# EasyEDA schematic SCH_IMU_Tester_2024-10-07.json

## Sheets
1 Sheet_1: TITLE: Tester PC; REV: 1.0; Date: 2024-10-07; Sheet: 1/2; Drawn By: BillyF; Company: Figure
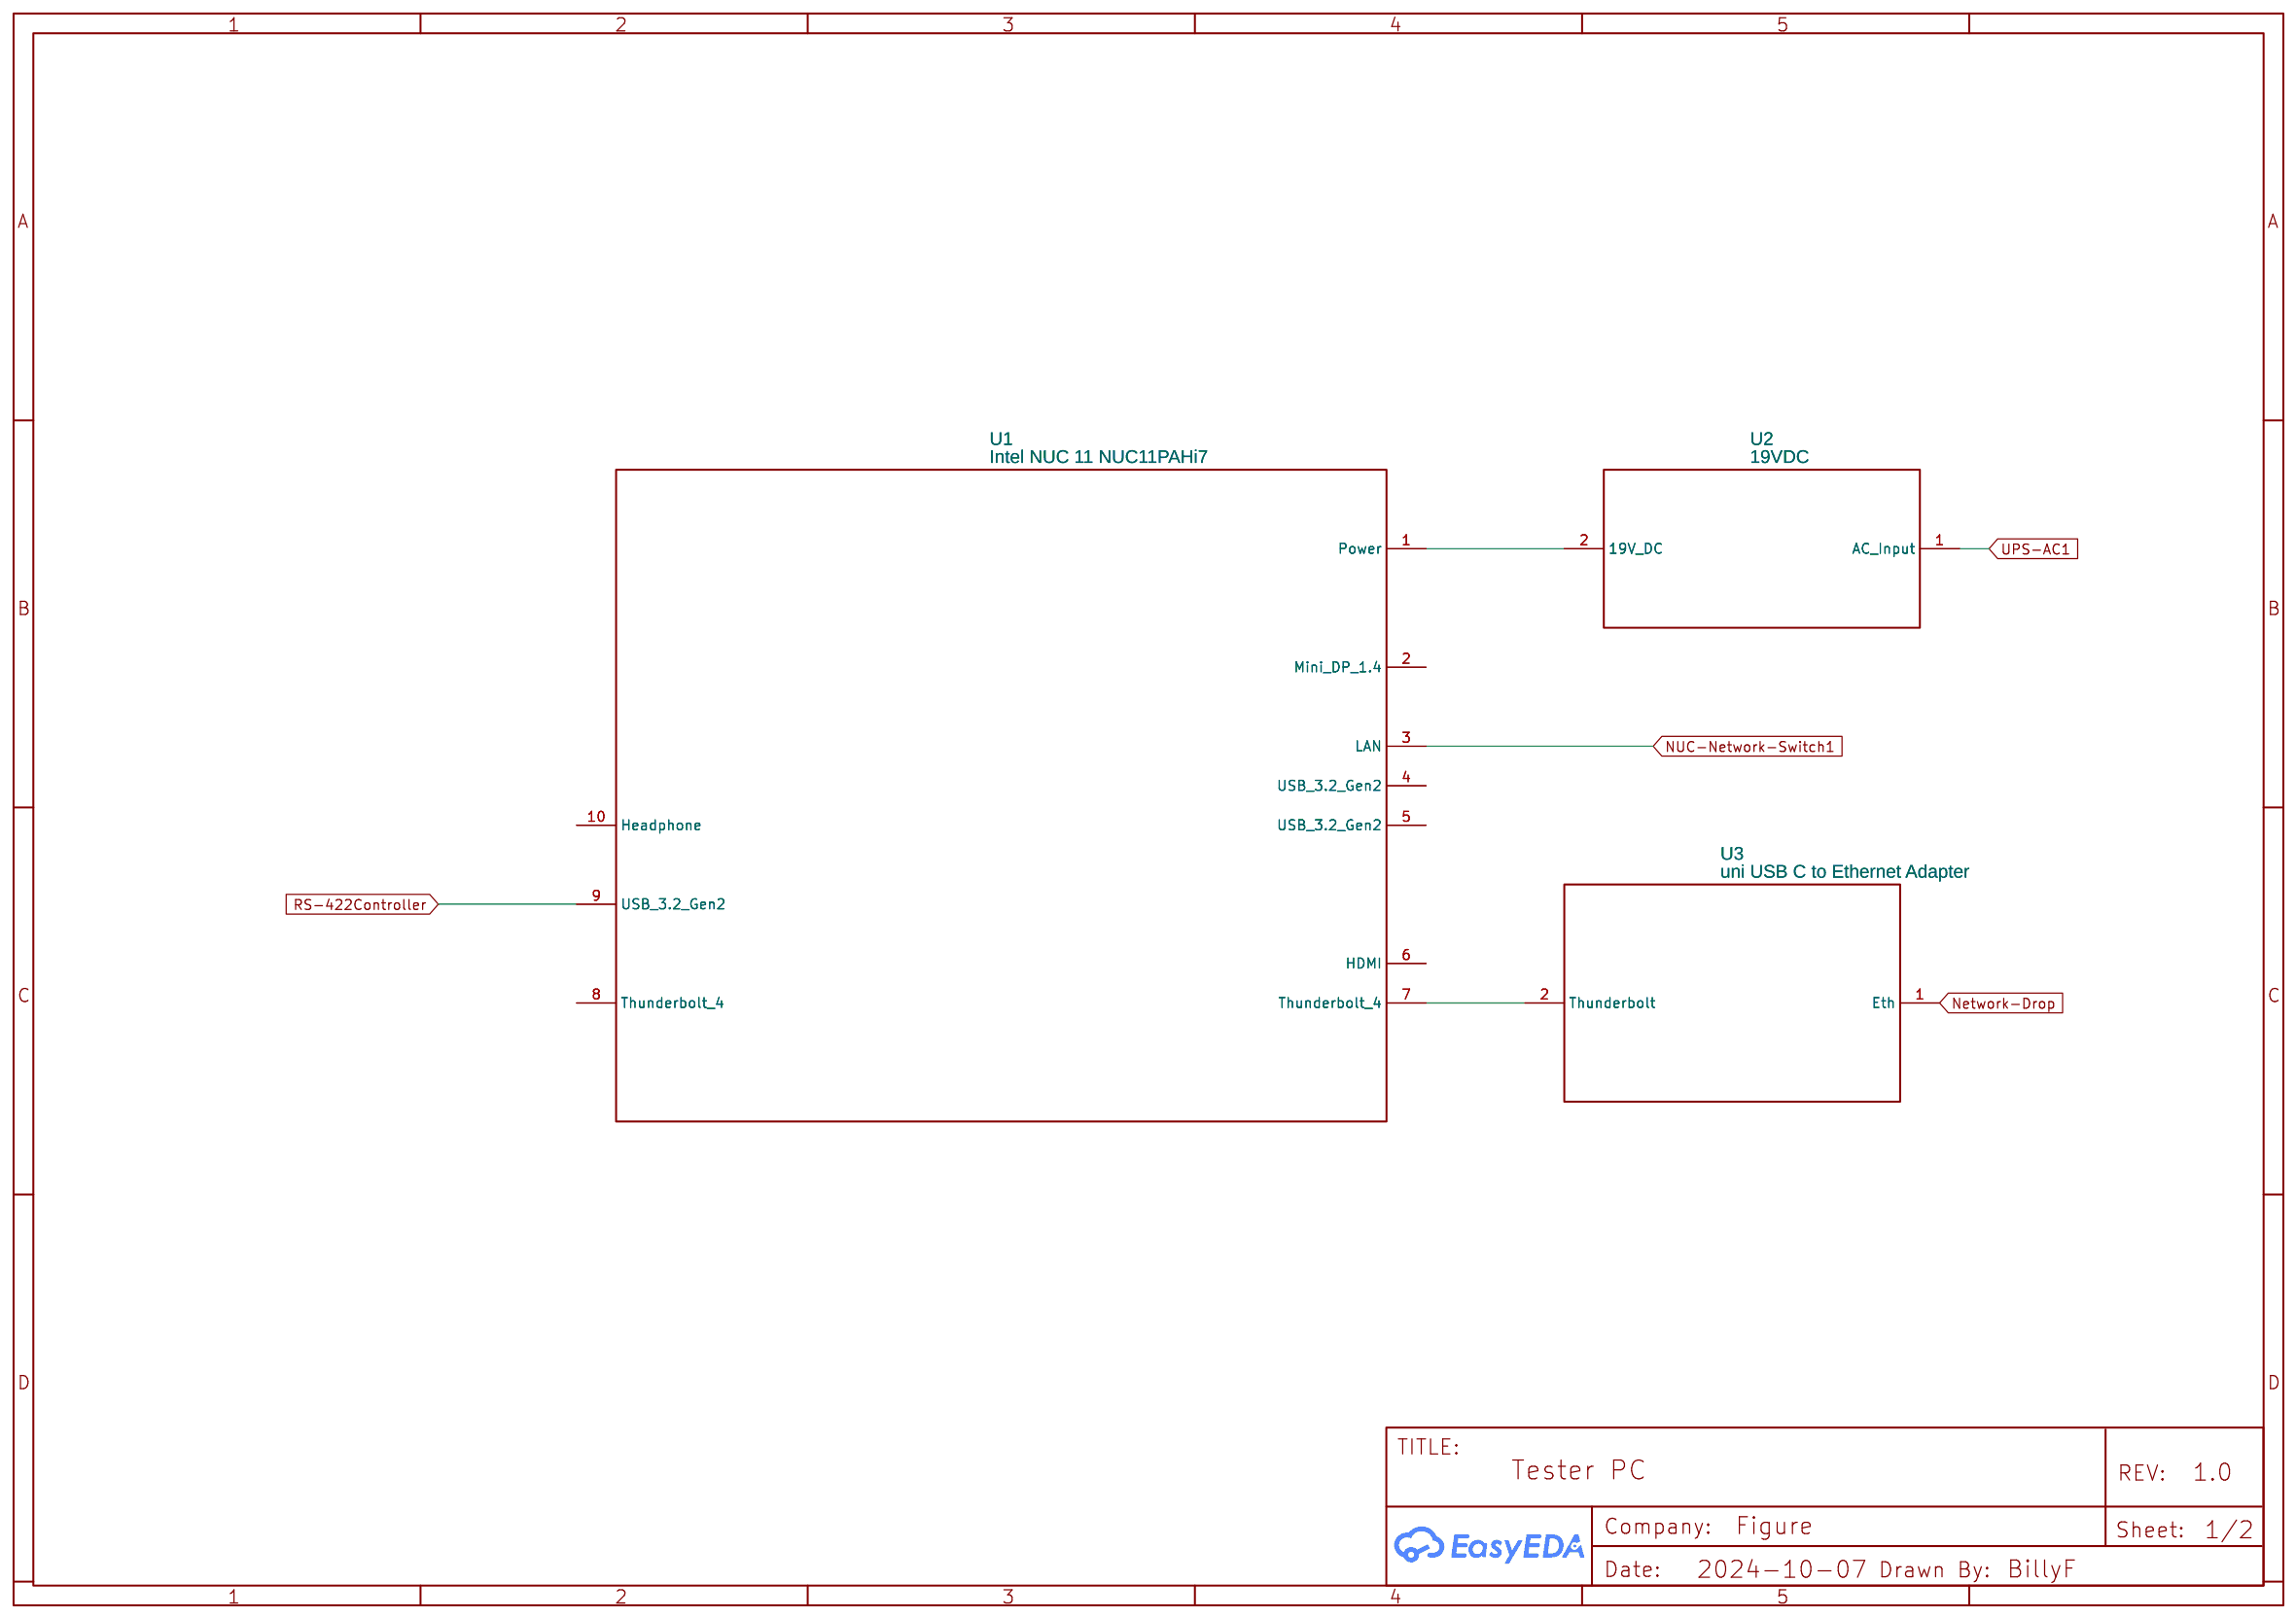
[diagram p0: Sheet_1]
2 Sheet_2: TITLE: Network Switch; Sheet: 2/2
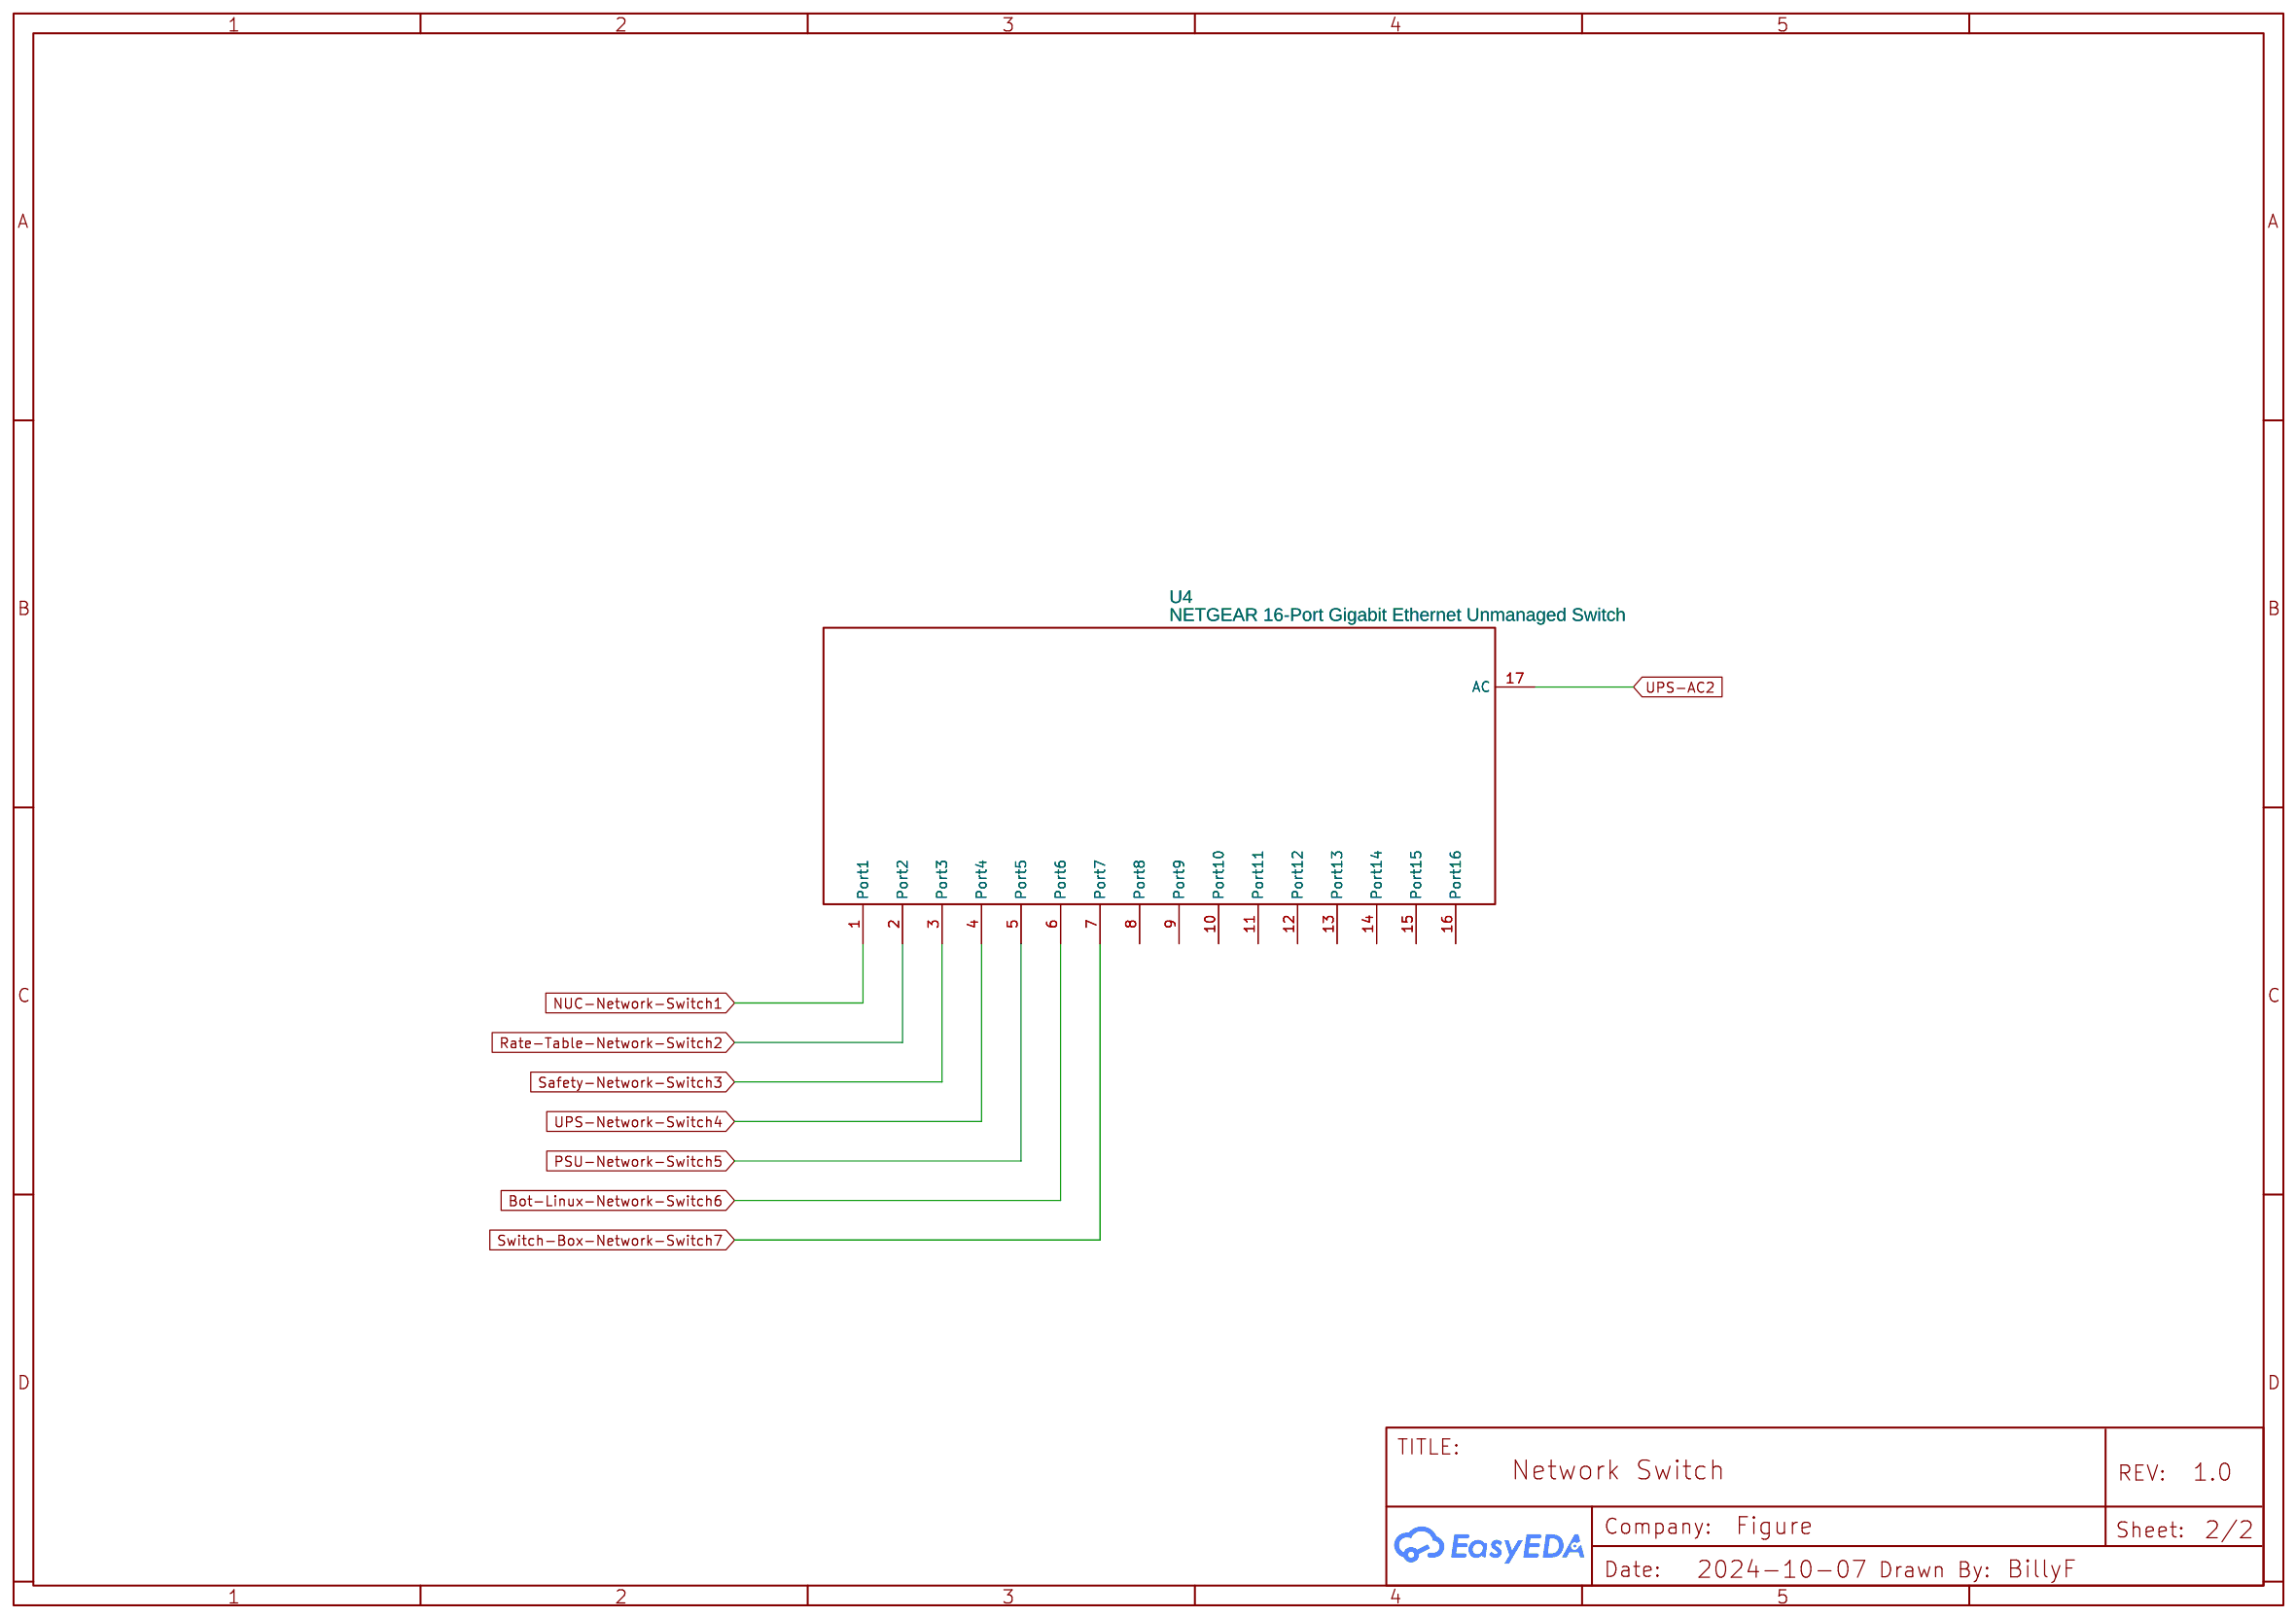
[diagram p1: Sheet_2]

## Parts
sheet Sheet_1
U1  Intel NUC 11 NUC11PAHi7
U2  19VDC
U3  uni USB C to Ethernet Adapter
sheet Sheet_2
U4  NETGEAR 16-Port Gigabit Ethernet Unmanaged Switch

## Library data of the parts
U1 = Intel NUC 11 NUC11PAHi7: Supplier: Intel; Contributor: BillyF
U2 = 19VDC: Contributor: BillyF
U3 = uni USB C to Ethernet Adapter: Contributor: BillyF
U4 = NETGEAR 16-Port Gigabit Ethernet Unmanaged Switch: Manufacturer Part: JGS516; link: https://www.amazon.com/NETGEAR-Ethernet-Unmanaged-Protection-JGS516NA/dp/B0002CWPOK/ref=sr_1_8?crid=1B0VO0G39P0BO&dib=eyJ2IjoiMSJ9.Rt9KtmhHiYyepGoA06Bjv191d3zwGYnhjJKi23xlEfxlYru0F-tjqLBrbaFMBsh5G7VEIR2uG1Qn40sYGH7cICwPqnnhzdK38Lp5DcmtqvBKiGFR5_v4cmS-6ZiTHLQiZ_5vsX_L8m7-NO8dtiMuauSUsFUR0QuYgVImflfK0I9ql7DUGaPWdyMLFS9Zb7PfgOLLOjscD-W1hNpIy5WMCa2zJscBoGl-5kNmF-eB5ytM24X5tmyL_UFpwevlrhLz10W08rdn1VAmYsWP7O2RUedP1G6Uh-9G1I3j8qAB4gk.Ry_gxoTliL8f98kyfbMG32i2H8ZEw4EnefcwspNfSpI&dib_tag=se&keywords=16+port+gigabit+switch&qid=1728289846&s=electronics&sprefix=16+port+gigabit+switch%2Celectronics%2C135&sr=1-8; Contributor: billyf

## Nets
Bot-Linux-Network-Switch6: U4.6(Port6)
Network-Drop: U3.1(Eth)
NUC-Network-Switch1: U1.3(LAN) U4.1(Port1)
PSU-Network-Switch5: U4.5(Port5)
Rate-Table-Network-Switch2: U4.2(Port2)
RS-422Controller: U1.9(USB 3.2 Gen2)
Safety-Network-Switch3: U4.3(Port3)
Switch-Box-Network-Switch7: U4.7(Port7)
UPS-AC1: U2.1(AC Input)
UPS-AC2: U4.17(AC)
UPS-Network-Switch4: U4.4(Port4)
Net-(U1-1): U1.1(Power) U2.2(19V DC)
Net-(U1-7): U1.7(Thunderbolt 4) U3.2(Thunderbolt)

Not connected (* = marked no-connect by the designer): U1 2(Mini DP 1.4) 4(USB 3.2 Gen2) 5(USB 3.2 Gen2) 6(HDMI) 8(Thunderbolt 4) 10(Headphone); U4 8(Port8) 9(Port9) 10(Port10) 11(Port11) 12(Port12) 13(Port13) 14(Port14) 15(Port15) 16(Port16)
